# Altium schematic sheet Main.SchDoc
size A2; SheetNumber: 1; SheetTotal: 1
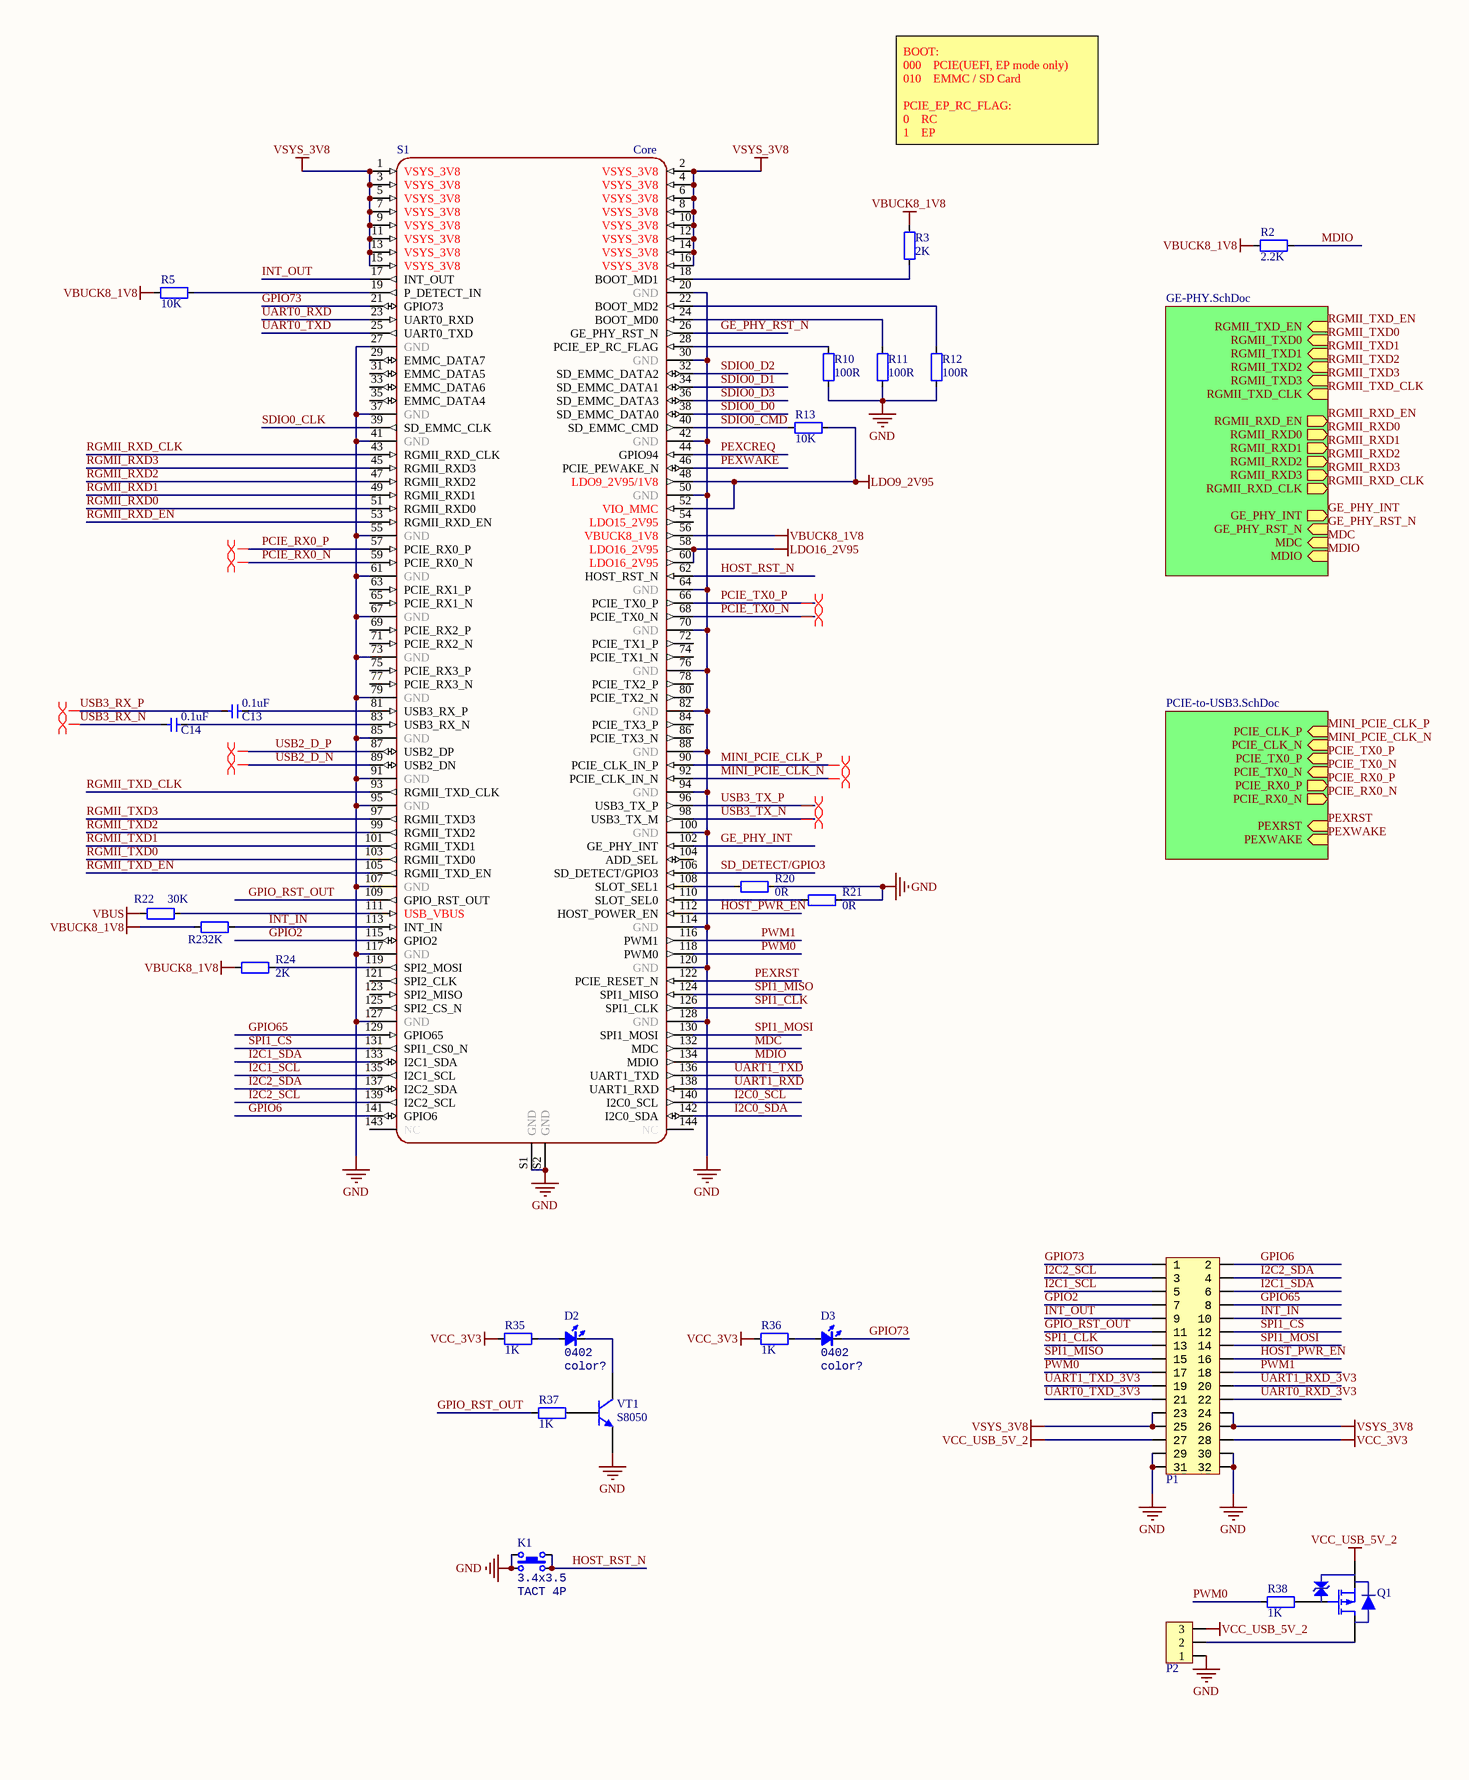
[diagram p0: Main.SchDoc, left]
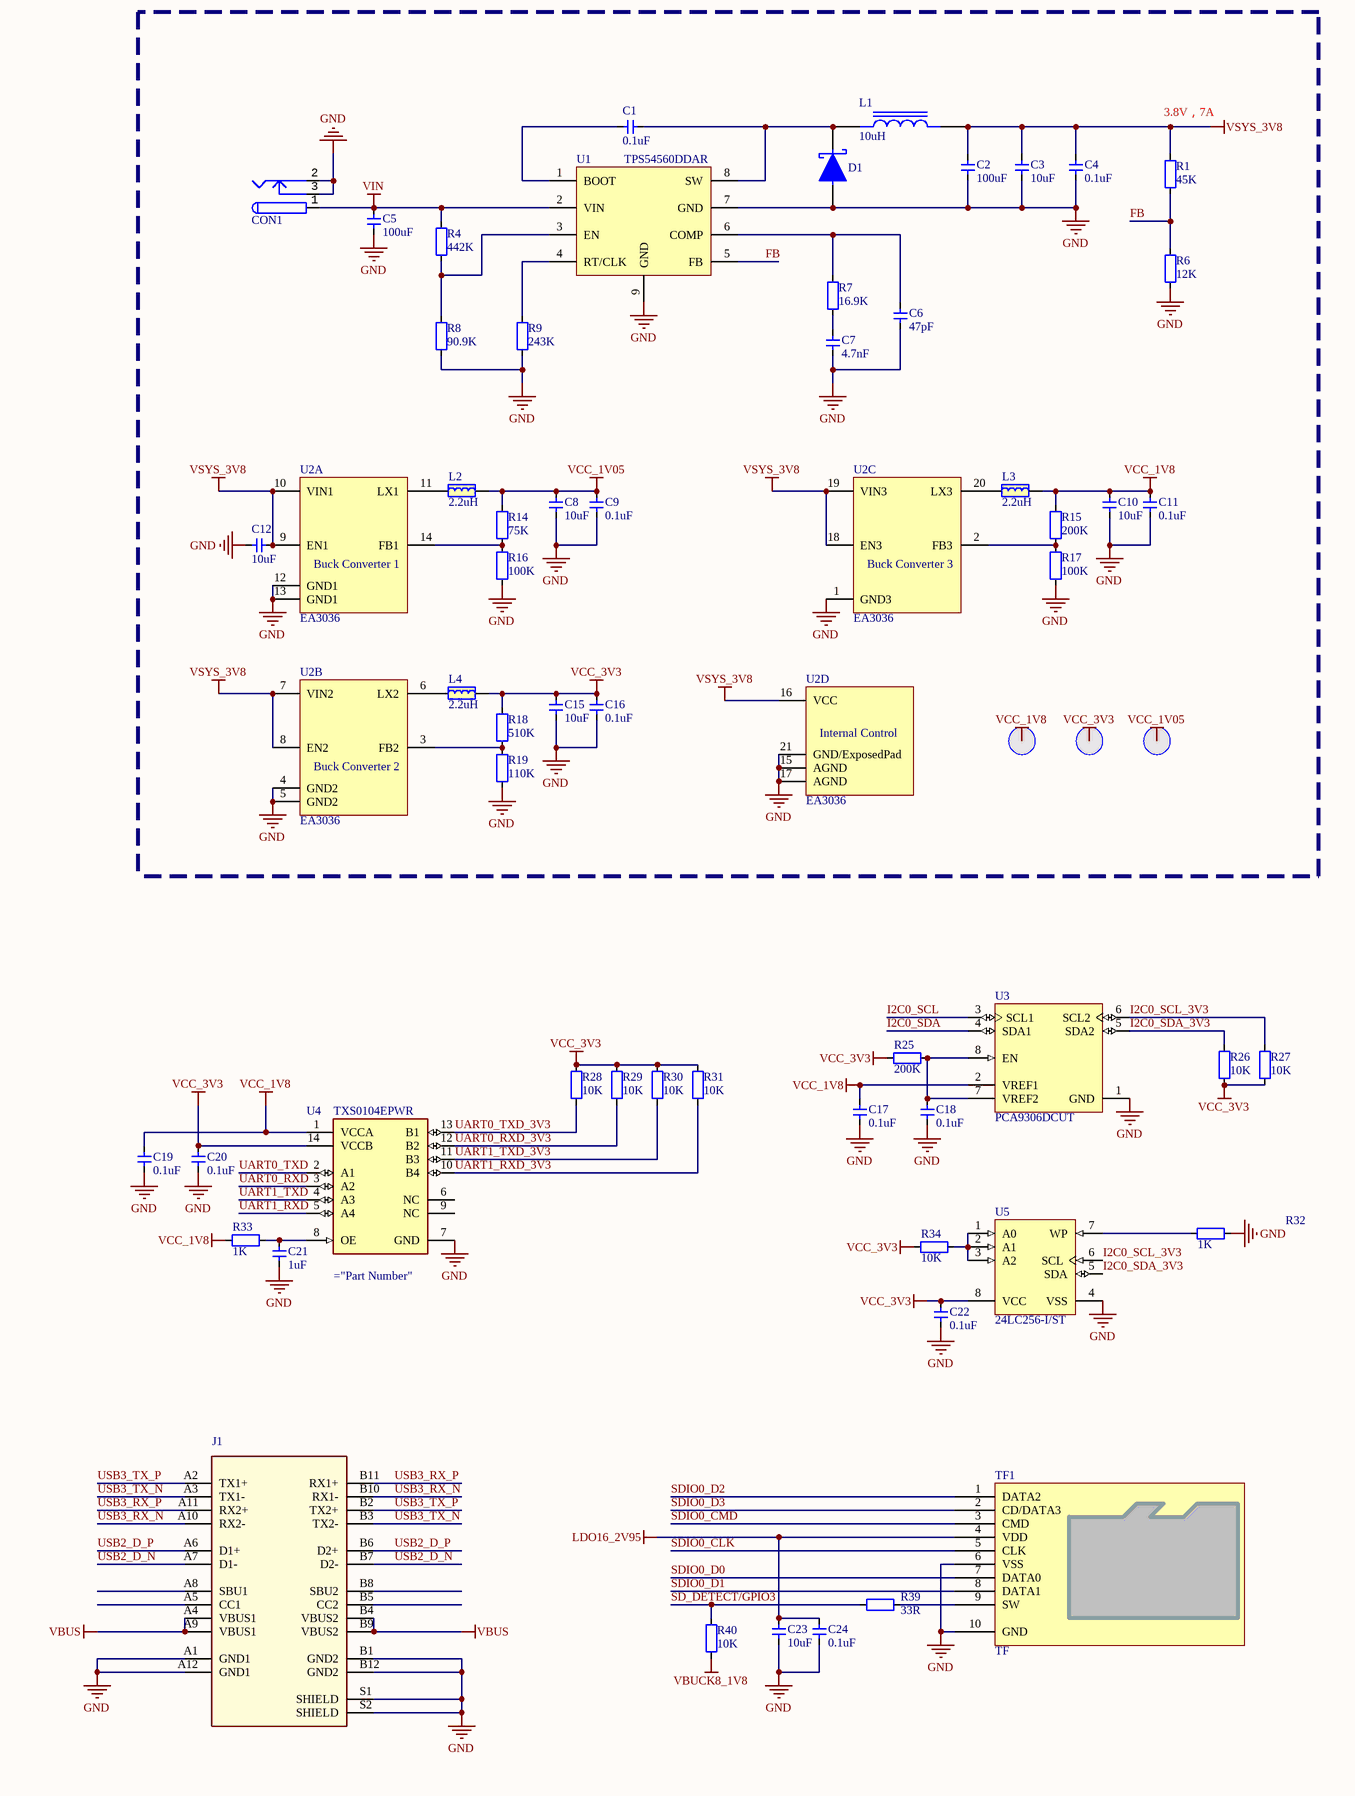
[diagram p1: Main.SchDoc, right]

## Parts
C1  0.1uF  [CAP_0402]
C2  100uF  [1206-CAP]
C3  10uF  [CAP_0402]
C4  0.1uF  [CAP_0402]
C5  100uF  [1206-CAP]
C6  47pF  [CAP_0402]
C7  4.7nF  [CAP_0402]
C8  10uF  [CAP_0402]
C9  0.1uF  [CAP_0402]
C10  10uF  [CAP_0402]
C11  0.1uF  [CAP_0402]
C12  10uF  [CAP_0402]
C13  0.1uF  [CAP_0402]
C14  0.1uF  [CAP_0402]
C15  10uF  [CAP_0402]
C16  0.1uF  [CAP_0402]
C17  0.1uF  [CAP_0402]
C18  0.1uF  [CAP_0402]
C19  0.1uF  [CAP_0402]
C20  0.1uF  [CAP_0402]
C21  1uF  [CAP_0402]
C22  0.1uF  [CAP_0402]
C23  10uF  [CAP_0402]
C24  0.1uF  [CAP_0402]
CON1  PowerJack_2.5  [KLD_0202]  (value not drawn)
D1  B560C-13-F  [DO-214AB-SMC]  (value not drawn)
D2  Type: 0402  [LED_0402_ORANGE]  (hidden comment: color?)
D3  Type: 0402  [LED_0402_GREEN]  (hidden comment: color?)
J1  USB-TYPE-C-TE  [USB TYPE C TE]  (value not drawn)
K1  value 3.4x3.5  [ButtonTACT_3.5*3.55_90]  (hidden comment: TACT 4P)
L1  10uH  [IND_1040]
L2  2.2uH  [2520-L]
L3  2.2uH  [2520-L]
L4  2.2uH  [2520-L]
P1  HDR2x16_2.54  [HDR2X16_2.54_180]  (value not drawn)
P2  HDR1x3_1.25  [接插件 3P]  (value not drawn)
Q1  AO3415A  [SOT23-3]  (value not drawn)
R1  45K  [RES_0402]
R2  2.2K  [RES_0402]
R3  2K  [RES_0402]
R4  442K  [RES_0402]
R5  10K  [RES_0402]
R6  12K  [RES_0402]
R7  16.9K  [RES_0402]
R8  90.9K  [RES_0402]
R9  243K  [RES_0402]
R10  100R  [RES_0402]
R11  100R  [RES_0402]
R12  100R  [RES_0402]
R13  10K  [RES_0402]
R14  75K  [RES_0402]
R15  200K  [RES_0402]
R16  100K  [RES_0402]
R17  100K  [RES_0402]
R18  510K  [RES_0402]
R19  110K  [RES_0402]
R20  0R  [RES_0402]
R21  0R  [RES_0402]
R22  30K  [RES_0402]
R23  2K  [RES_0402]
R24  2K  [RES_0402]
R25  200K  [RES_0402]
R26  10K  [RES_0402]
R27  10K  [RES_0402]
R28  10K  [RES_0402]
R29  10K  [RES_0402]
R30  10K  [RES_0402]
R31  10K  [RES_0402]
R32  1K  [RES_0402]
R33  1K  [RES_0402]
R34  10K  [RES_0402]
R35  1K  [RES_0402]
R36  1K  [RES_0402]
R37  1K  [RES_0402]
R38  1K  [RES_0402]
R39  33R  [RES_0402]
R40  10K  [RES_0402]
S1  Core  [ATLAS-200]
T1  测试点  [TEST_PT]  (value not drawn)
T2  测试点  [TEST_PT]  (value not drawn)
T3  测试点  [TEST_PT]  (value not drawn)
TF1  TF  [TF-SOCKET]
U1  TPS54560DDAR  [SO-8-PAD]
U2  EA3036  [QFN-20]  (parts A,B,C,D of 4)
U3  PCA9306DCUT  [VSSOP-8]
U4  TXS0104EPWR  [R-PDSO-G14]
U5  24LC256-I/ST  [TSSOP-8]
VT1  S8050  [SMT_TRIODE_NPN]

## Sub-sheets
GE-PHY = GE-PHY.SchDoc: RGMII_RXD_EN (out), RGMII_RXD0 (out), RGMII_TXD3 (in), RGMII_RXD3 (out), RGMII_TXD0 (in), RGMII_RXD1 (out), RGMII_RXD2 (out), RGMII_TXD_EN (in), GE_PHY_RST_N (in), RGMII_TXD_CLK (in), RGMII_RXD_CLK (out), RGMII_TXD2 (in), RGMII_TXD1 (in), MDIO (in), MDC (in), GE_PHY_INT (out)
PCIE-to-USB3 = PCIE-to-USB3.SchDoc: PEXWAKE (in), PEXRST (in), PCIE_CLK_N (in), PCIE_RX0_N (out), PCIE_TX0_P (in), PCIE_TX0_N (in), PCIE_RX0_P (out), PCIE_CLK_P (in)

## Nets
GND: C2.1 C3.2 C4.2 C5.1 C6.1 C7.1 C8.2 C9.2 C10.2 C11.2 C12.1 C15.2 C16.2 C17.1 C18.1 C19.1 C20.1 C21.1 C22.1 C23.2 C24.2 CON1.2 CON1.3 D1.2(A) J1.A1(GND1) J1.A12(GND1) J1.B1(GND2) J1.B12(GND2) J1.S1(SHIELD) J1.S2(SHIELD) K1.1 K1.3 P1.29 P1.30 P1.31 P1.32 P2.1 R6.1 R8.1 R9.1 R10.2 R11.2 R12.2 R16.1 R17.1 R19.1 R20.1 R21.1 R32.1 S1.20(GND) S1.27(GND) S1.30(GND) S1.37(GND) S1.41(GND) S1.42(GND) S1.50(GND) S1.55(GND) S1.61(GND) S1.64(GND) S1.67(GND) S1.70(GND) S1.73(GND) S1.76(GND) S1.79(GND) S1.82(GND) S1.85(GND) S1.88(GND) S1.91(GND) S1.94(GND) S1.95(GND) S1.100(GND) S1.107(GND) S1.114(GND) S1.117(GND) S1.120(GND) S1.127(GND) S1.128(GND) S1.S1(GND) S1.S2(GND) TF1.6(VSS) TF1.10(GND) U1.7(GND) U1.9(GND) U2.1(GND3) U2.4(GND2) U2.5(GND2) U2.12(GND1) U2.13(GND1) U2.15(AGND) U2.17(AGND) U2.21(GND/ExposedPad) U3.1(GND) U4.7(GND) U5.4(VSS) VT1.2(E)
LDO9_2V95: R13.2 S1.48(LDO9_2V95/1V8) S1.52(VIO_MMC)
LDO16_2V95: C23.1 C24.1 S1.58(LDO16_2V95) S1.60(LDO16_2V95) TF1.4(VDD)
VBUCK8_1V8: R2.1 R3.1 R5.1 R23.2 R24.2 R40.1 S1.56(VBUCK8_1V8)
VBUS: J1.A4(VBUS1) J1.A9(VBUS1) J1.B4(VBUS2) J1.B9(VBUS2) R22.2
VCC_1V05: C8.1 C9.1 L2.2 R14.2 T3.0
VCC_1V8: C10.1 C11.1 C17.2 C19.2 L3.2 R15.2 R33.2 T1.0 U3.2(VREF1) U4.1(VCCA)
VCC_3V3: C15.1 C16.1 C20.2 C22.2 L4.2 P1.28 R18.2 R25.1 R26.1 R27.1 R28.1 R29.1 R30.1 R31.1 R34.2 R35.1 R36.1 T2.0 U4.14(VCCB) U5.8(VCC)
VCC_USB_5V_2: P1.27 P2.3 Q1.2(S)
VIN: C5.2 CON1.1 R4.2 U1.2(VIN)
VSYS_3V8: C2.2 C3.1 C4.1 C12.2 L1.2 P1.23 P1.24 P1.25 P1.26 R1.2 S1.1(VSYS_3V8) S1.2(VSYS_3V8) S1.3(VSYS_3V8) S1.4(VSYS_3V8) S1.5(VSYS_3V8) S1.6(VSYS_3V8) S1.7(VSYS_3V8) S1.8(VSYS_3V8) S1.9(VSYS_3V8) S1.10(VSYS_3V8) S1.11(VSYS_3V8) S1.12(VSYS_3V8) S1.13(VSYS_3V8) S1.14(VSYS_3V8) S1.15(VSYS_3V8) S1.16(VSYS_3V8) U2.7(VIN2) U2.8(EN2) U2.9(EN1) U2.10(VIN1) U2.16(VCC) U2.18(EN3) U2.19(VIN3)
FB: R1.1 R6.2 U1.5(FB)
GE_PHY_INT: S1.102(GE_PHY_INT) ; sheet GE-PHY/GE_PHY_INT
GE_PHY_RST_N: S1.26(GE_PHY_RST_N) ; sheet GE-PHY/GE_PHY_RST_N
GPIO2: P1.7 S1.115(GPIO2)
GPIO6: P1.2 S1.141(GPIO6)
GPIO65: P1.8 S1.129(GPIO65)
GPIO73: D3.2(K) P1.1 S1.21(GPIO73)
GPIO_RST_OUT: P1.11 R37.1 S1.109(GPIO_RST_OUT)
HOST_PWR_EN: P1.16 S1.112(HOST_POWER_EN)
HOST_RST_N: K1.2 K1.4 S1.62(HOST_RST_N)
I2C0_SCL: S1.140(I2C0_SCL) U3.3(SCL1)
I2C0_SCL_3V3: R27.2 U3.6(SCL2) U5.6(SCL)
I2C0_SDA: S1.142(I2C0_SDA) U3.4(SDA1)
I2C0_SDA_3V3: R26.2 U3.5(SDA2) U5.5(SDA)
I2C1_SCL: P1.5 S1.135(I2C1_SCL)
I2C1_SDA: P1.6 S1.133(I2C1_SDA)
I2C2_SCL: P1.3 S1.139(I2C2_SCL)
I2C2_SDA: P1.4 S1.137(I2C2_SDA)
INT_IN: P1.10 R23.1 S1.113(INT_IN)
INT_OUT: P1.9 S1.17(INT_OUT)
MDC: S1.132(MDC) ; sheet GE-PHY/MDC
MDIO: R2.2 S1.134(MDIO) ; sheet GE-PHY/MDIO
MINI_PCIE_CLK_N: S1.92(PCIE_CLK_IN_N) ; sheet PCIE-to-USB3/PCIE_CLK_N
MINI_PCIE_CLK_P: S1.90(PCIE_CLK_IN_P) ; sheet PCIE-to-USB3/PCIE_CLK_P
PCIE_RX0_N: S1.59(PCIE_RX0_N) ; sheet PCIE-to-USB3/PCIE_RX0_N
PCIE_RX0_P: S1.57(PCIE_RX0_P) ; sheet PCIE-to-USB3/PCIE_RX0_P
PCIE_TX0_N: S1.68(PCIE_TX0_N) ; sheet PCIE-to-USB3/PCIE_TX0_N
PCIE_TX0_P: S1.66(PCIE_TX0_P) ; sheet PCIE-to-USB3/PCIE_TX0_P
PEXCREQ: S1.44(GPIO94)
PEXRST: S1.122(PCIE_RESET_N) ; sheet PCIE-to-USB3/PEXRST
PEXWAKE: S1.46(PCIE_PEWAKE_N) ; sheet PCIE-to-USB3/PEXWAKE
PWM0: P1.17 R38.1 S1.118(PWM0)
PWM1: P1.18 S1.116(PWM1)
RGMII_RXD0: S1.51(RGMII_RXD0) ; sheet GE-PHY/RGMII_RXD0
RGMII_RXD1: S1.49(RGMII_RXD1) ; sheet GE-PHY/RGMII_RXD1
RGMII_RXD2: S1.47(RGMII_RXD2) ; sheet GE-PHY/RGMII_RXD2
RGMII_RXD3: S1.45(RGMII_RXD3) ; sheet GE-PHY/RGMII_RXD3
RGMII_RXD_CLK: S1.43(RGMII_RXD_CLK) ; sheet GE-PHY/RGMII_RXD_CLK
RGMII_RXD_EN: S1.53(RGMII_RXD_EN) ; sheet GE-PHY/RGMII_RXD_EN
RGMII_TXD0: S1.103(RGMII_TXD0) ; sheet GE-PHY/RGMII_TXD0
RGMII_TXD1: S1.101(RGMII_TXD1) ; sheet GE-PHY/RGMII_TXD1
RGMII_TXD2: S1.99(RGMII_TXD2) ; sheet GE-PHY/RGMII_TXD2
RGMII_TXD3: S1.97(RGMII_TXD3) ; sheet GE-PHY/RGMII_TXD3
RGMII_TXD_CLK: S1.93(RGMII_TXD_CLK) ; sheet GE-PHY/RGMII_TXD_CLK
RGMII_TXD_EN: S1.105(RGMII_TXD_EN) ; sheet GE-PHY/RGMII_TXD_EN
SD_DETECT/GPIO3: R39.2 R40.2 S1.106(SD_DETECT/GPIO3)
SDIO0_CLK: S1.39(SD_EMMC_CLK) TF1.5(CLK)
SDIO0_CMD: R13.1 S1.40(SD_EMMC_CMD) TF1.3(CMD)
SDIO0_D0: S1.38(SD_EMMC_DATA0) TF1.7(DATA0)
SDIO0_D1: S1.34(SD_EMMC_DATA1) TF1.8(DATA1)
SDIO0_D2: S1.32(SD_EMMC_DATA2) TF1.1(DATA2)
SDIO0_D3: S1.36(SD_EMMC_DATA3) TF1.2(CD/DATA3)
SPI1_CLK: P1.13 S1.126(SPI1_CLK)
SPI1_CS: P1.12 S1.131(SPI1_CS0_N)
SPI1_MISO: P1.15 S1.124(SPI1_MISO)
SPI1_MOSI: P1.14 S1.130(SPI1_MOSI)
UART0_RXD: S1.23(UART0_RXD) U4.3(A2)
UART0_RXD_3V3: P1.22 R29.2 U4.12(B2)
UART0_TXD: S1.25(UART0_TXD) U4.2(A1)
UART0_TXD_3V3: P1.21 R28.2 U4.13(B1)
UART1_RXD: S1.138(UART1_RXD) U4.5(A4)
UART1_RXD_3V3: P1.20 R31.2 U4.10(B4)
UART1_TXD: S1.136(UART1_TXD) U4.4(A3)
UART1_TXD_3V3: P1.19 R30.2 U4.11(B3)
USB2_D_N: J1.A7(D1-) J1.B7(D2-) S1.89(USB2_DN)
USB2_D_P: J1.A6(D1+) J1.B6(D2+) S1.87(USB2_DP)
USB3_RX_N: C14.2 J1.A10(RX2-) J1.B10(RX1-)
USB3_RX_P: C13.2 J1.A11(RX2+) J1.B11(RX1+)
USB3_TX_N: J1.A3(TX1-) J1.B3(TX2-) S1.98(USB3_TX_M)
USB3_TX_P: J1.A2(TX1+) J1.B2(TX2+) S1.96(USB3_TX_P)
NetC1_1: C1.1 D1.1(C) L1.1 U1.8(SW)
NetC1_2: C1.2 U1.1(BOOT)
NetC6_2: C6.2 R7.2 U1.6(COMP)
NetC7_2: C7.2 R7.1
NetC13_1: C13.1 S1.81(USB3_RX_P)
NetC14_1: C14.1 S1.83(USB3_RX_N)
NetC18_2: C18.2 R25.2 U3.7(VREF2) U3.8(EN)
NetC21_2: C21.2 R33.1 U4.8(OE)
NetD2_1: D2.1(A) R35.2
NetD2_2: D2.2(K) VT1.3(C)
NetD3_1: D3.1(A) R36.2
NetL2_1: L2.1 U2.11(LX1)
NetL3_1: L3.1 U2.20(LX3)
NetL4_1: L4.1 U2.6(LX2)
NetP2_2: P2.2 Q1.3(D)
NetQ1_1: Q1.1(G) R38.2
NetR3_2: R3.2 S1.18(BOOT_MD1)
NetR4_1: R4.1 R8.2 U1.3(EN)
NetR5_2: R5.2 S1.19(P_DETECT_IN)
NetR9_2: R9.2 U1.4(RT/CLK)
NetR10_1: R10.1 S1.28(PCIE_EP_RC_FLAG)
NetR11_1: R11.1 S1.24(BOOT_MD0)
NetR12_1: R12.1 S1.22(BOOT_MD2)
NetR14_1: R14.1 R16.2 U2.14(FB1)
NetR15_1: R15.1 R17.2 U2.2(FB3)
NetR18_1: R18.1 R19.2 U2.3(FB2)
NetR20_2: R20.2 S1.108(SLOT_SEL1)
NetR21_2: R21.2 S1.110(SLOT_SEL0)
NetR22_1: R22.1 S1.111(USB_VBUS)
NetR24_1: R24.1 S1.119(SPI2_MOSI)
NetR32_2: R32.2 U5.7(WP)
NetR34_1: R34.1 U5.1(A0) U5.2(A1) U5.3(A2)
NetR37_2: R37.2 VT1.1(B)
NetR39_1: R39.1 TF1.9(SW)

Not connected (* = marked no-connect by the designer): J1 A5(CC1) A8(SBU1) B5(CC2) B8(SBU2); S1 29(EMMC_DATA7) 31(EMMC_DATA5) 33(EMMC_DATA6) 35(EMMC_DATA4) 54(LDO15_2V95) 63(PCIE_RX1_P) 65(PCIE_RX1_N) 69(PCIE_RX2_P) 71(PCIE_RX2_N) 72(PCIE_TX1_P) 74(PCIE_TX1_N) 75(PCIE_RX3_P) 77(PCIE_RX3_N) 78(PCIE_TX2_P) 80(PCIE_TX2_N) 84(PCIE_TX3_P) 86(PCIE_TX3_N) 104(ADD_SEL) 121(SPI2_CLK) 123(SPI2_MISO) 125(SPI2_CS_N) 143(NC) 144(NC); U4 6(NC) 9(NC)

## Layout directives
differential pair: MINI_PCIE_CLK_N, MINI_PCIE_CLK_P, PCIE_RX0_N, PCIE_RX0_P, PCIE_TX0_N, PCIE_TX0_P, USB2_D_N, USB2_D_P, USB3_RX_N, USB3_RX_P, USB3_TX_N, USB3_TX_P

## Notes on the sheet
- BOOT:
  000    PCIE(UEFI, EP mode only)
  010    EMMC / SD Card
  PCIE_EP_RC_FLAG:
  0    RC
  1    EP
- (near R1) 3.8V，7A
- (in symbol EA3036, part A) Buck Converter 1
- (in symbol EA3036, part B) Buck Converter 2
- (in symbol EA3036, part C) Buck Converter 3
- (in symbol EA3036, part D) Internal Control

## Library data of the parts
C1 C3 C4 C6-C24 = 电容-0402: Capacitor; Value: 0.1u
C2 C5 = 电容-1206: Capacitor; Value: 0.1u
CON1 = PowerJack_2.5: DC Power Jack
D2 D3 = LED_0402: LED; Value: color?
J1 = USB-TYPE-C-TE: SPLASH PROOF USB TYPE C REC, DUAL SMT; MP: 2295018-2; Number_of_Positions: 24; MF: TE Connectivity; Product_Type: Connector; Centerline_Pitch: .5 mm[.019 in]; EU_RoHS_Compliance: Compliant; Availability: Good; Package: None; Link: http://www.te.com/usa-en/product-2295018-2.html; Price: 1.84 USD; SnapEDA_Link: https://www.snapeda.com/parts/2295018-2/TE%20Connectivity%20AMP%20Connectors/view-part/?ref=snap; Value: *
K1 = ButtonTACT: Button; type: TACT 4P
L1 = 电感-1040: Fixed Inductors 4.7uH 30% SMD 1240; MF: Bourns; MP: SRR1240-4R7Y; Price: None; SnapEDA_Link: https://www.snapeda.com/parts/SRR1240-4R7Y/Bourns/view-part/1646614/?ref=snap; Check_prices: https://www.snapeda.com/parts/SRR1240-4R7Y/Bourns/view-part/1646614/?ref=eda; Availability: Bad; Package: None; Value: *
L2-L4 = 电感-2520: 磁珠
P1 = HDR2x16_2.54: Header
P2 = HDR1x3_1.25: Header
Q1 = AO3415A: MOSFET; Published: 8-Jun-2000; LatestRevisionDate: 17-Jul-2002; LatestRevisionNote: Re-released for DXP Platform.; PackageVersion: 1995/1996; PackageReference: E3; Publisher: Altium Limited; PackageDescription: TO, Flat Index; 3 In-Line, Axial Leads; Body Dia. 4.6mm; Lead Dia. 0.5 mm (max)
R1-R40 = 电阻-0402: Resistor; Value: 22R
S1 = Atlas-200: Atlas-A200 AI-SOM
TF1 = TF卡座: 8脚自弹
U1 = TPS54560DDAR: DC-DC Convter
U2 = EA3036: EA3036 is a 3CH power management IC for applications powered by one Li-Ion battery or a DC 5V adapter.
U3 = PCA9306DCUT: Dual Bi-Directional I2C-Bus and SMBus Voltage Level-Translator, 0 to 5.5 V, -40 to 85 degC, 8-pin US8 (DCU), Green (RoHS & no Sb/Br); Manufacturer: Texas Instruments; SubFamily: I2C Special Function; Function: Voltage Translator; fSCLK(Max)(MHz): 400; Open Drain I/O Type: Yes; No. of Outputs: 2; Vcc range(V): 0 to 5.5; Rating: Catalog; tpd max(ns): 1.5; Eco-Plan: Green (RoHS & no Sb/Br); PartNumber: PCA9306DCUT; ComponentLink1Description: Datasheet; ComponentLink2Description: Package Specification; DatasheetVersion: SCPS113J; ComponentLink1URL: http://www.ti.com/general/docs/lit/getliterature.tsp?genericPartNumber=PCA9306&fileType=pdf; Code_JEDEC: MO-187-CA; ComponentLink2URL: http://www.ti.com/litv/pdf/mpds050d; Enable Pin: Yes; PackageReference: DCU8; 5V Tolerant I/O: Yes; On-Chip Power-on-Reset: No; PackageVersion: revF, Jul-2005; PackageDescription: 8-Pin Thin Shrink Small Outline Package 0.5 mm Pitch; Mounting Technology: Surface Mount; Max Frequency(kHz): 400
U5 = 24LC256-I/ST: 256Kbit, 400kHz, 2.5V, I2C Serial EEPROM, 8-Pin TSSOP, Industrial Temperature; Code_JEDEC: MO-153; PackageVersion: revBB, Aug-2009; PackageReference: TSSOP-ST8; PackageDescription: 8-Lead Plastic Thin Shrink Small Outline (ST) - 4.4mm Body [TSSOP]; DatasheetVersion: revP, Oct-2007; PartNumber: 24LC256-I/ST
VT1 = SMT_TRIODE_NPN: Surface mount NPN transistor, package SOT-23